# Altium schematic sheet BG1094_MIPI_CAM.SchDoc: =project_title
size Tabloid; PageSetup: Record=PageOptions|CenterHorizontal=True|CenterVertical=True|PrintScale=0.73|XCorrection=1.00|YCorrection=1.00|PrintKind=0|BorderSize=5000000|LeftOffset=0|BottomOffset=0|Orientation=2|PaperLength=1000|PaperWidth=1000|Scale=100|PaperSource=7|PrintQuality=-4|MediaType=1|DitherType=10|PaperKind=A4|PrintScaleMode=1; CompanyName: Luxonis Holding; Organization: Luxonis Holding; Address1: 1925 Harmony Park Drive; Address2: Westminster, CO; Address3: 80234; Address4: United States; SheetNumber: 2; SheetTotal: 5
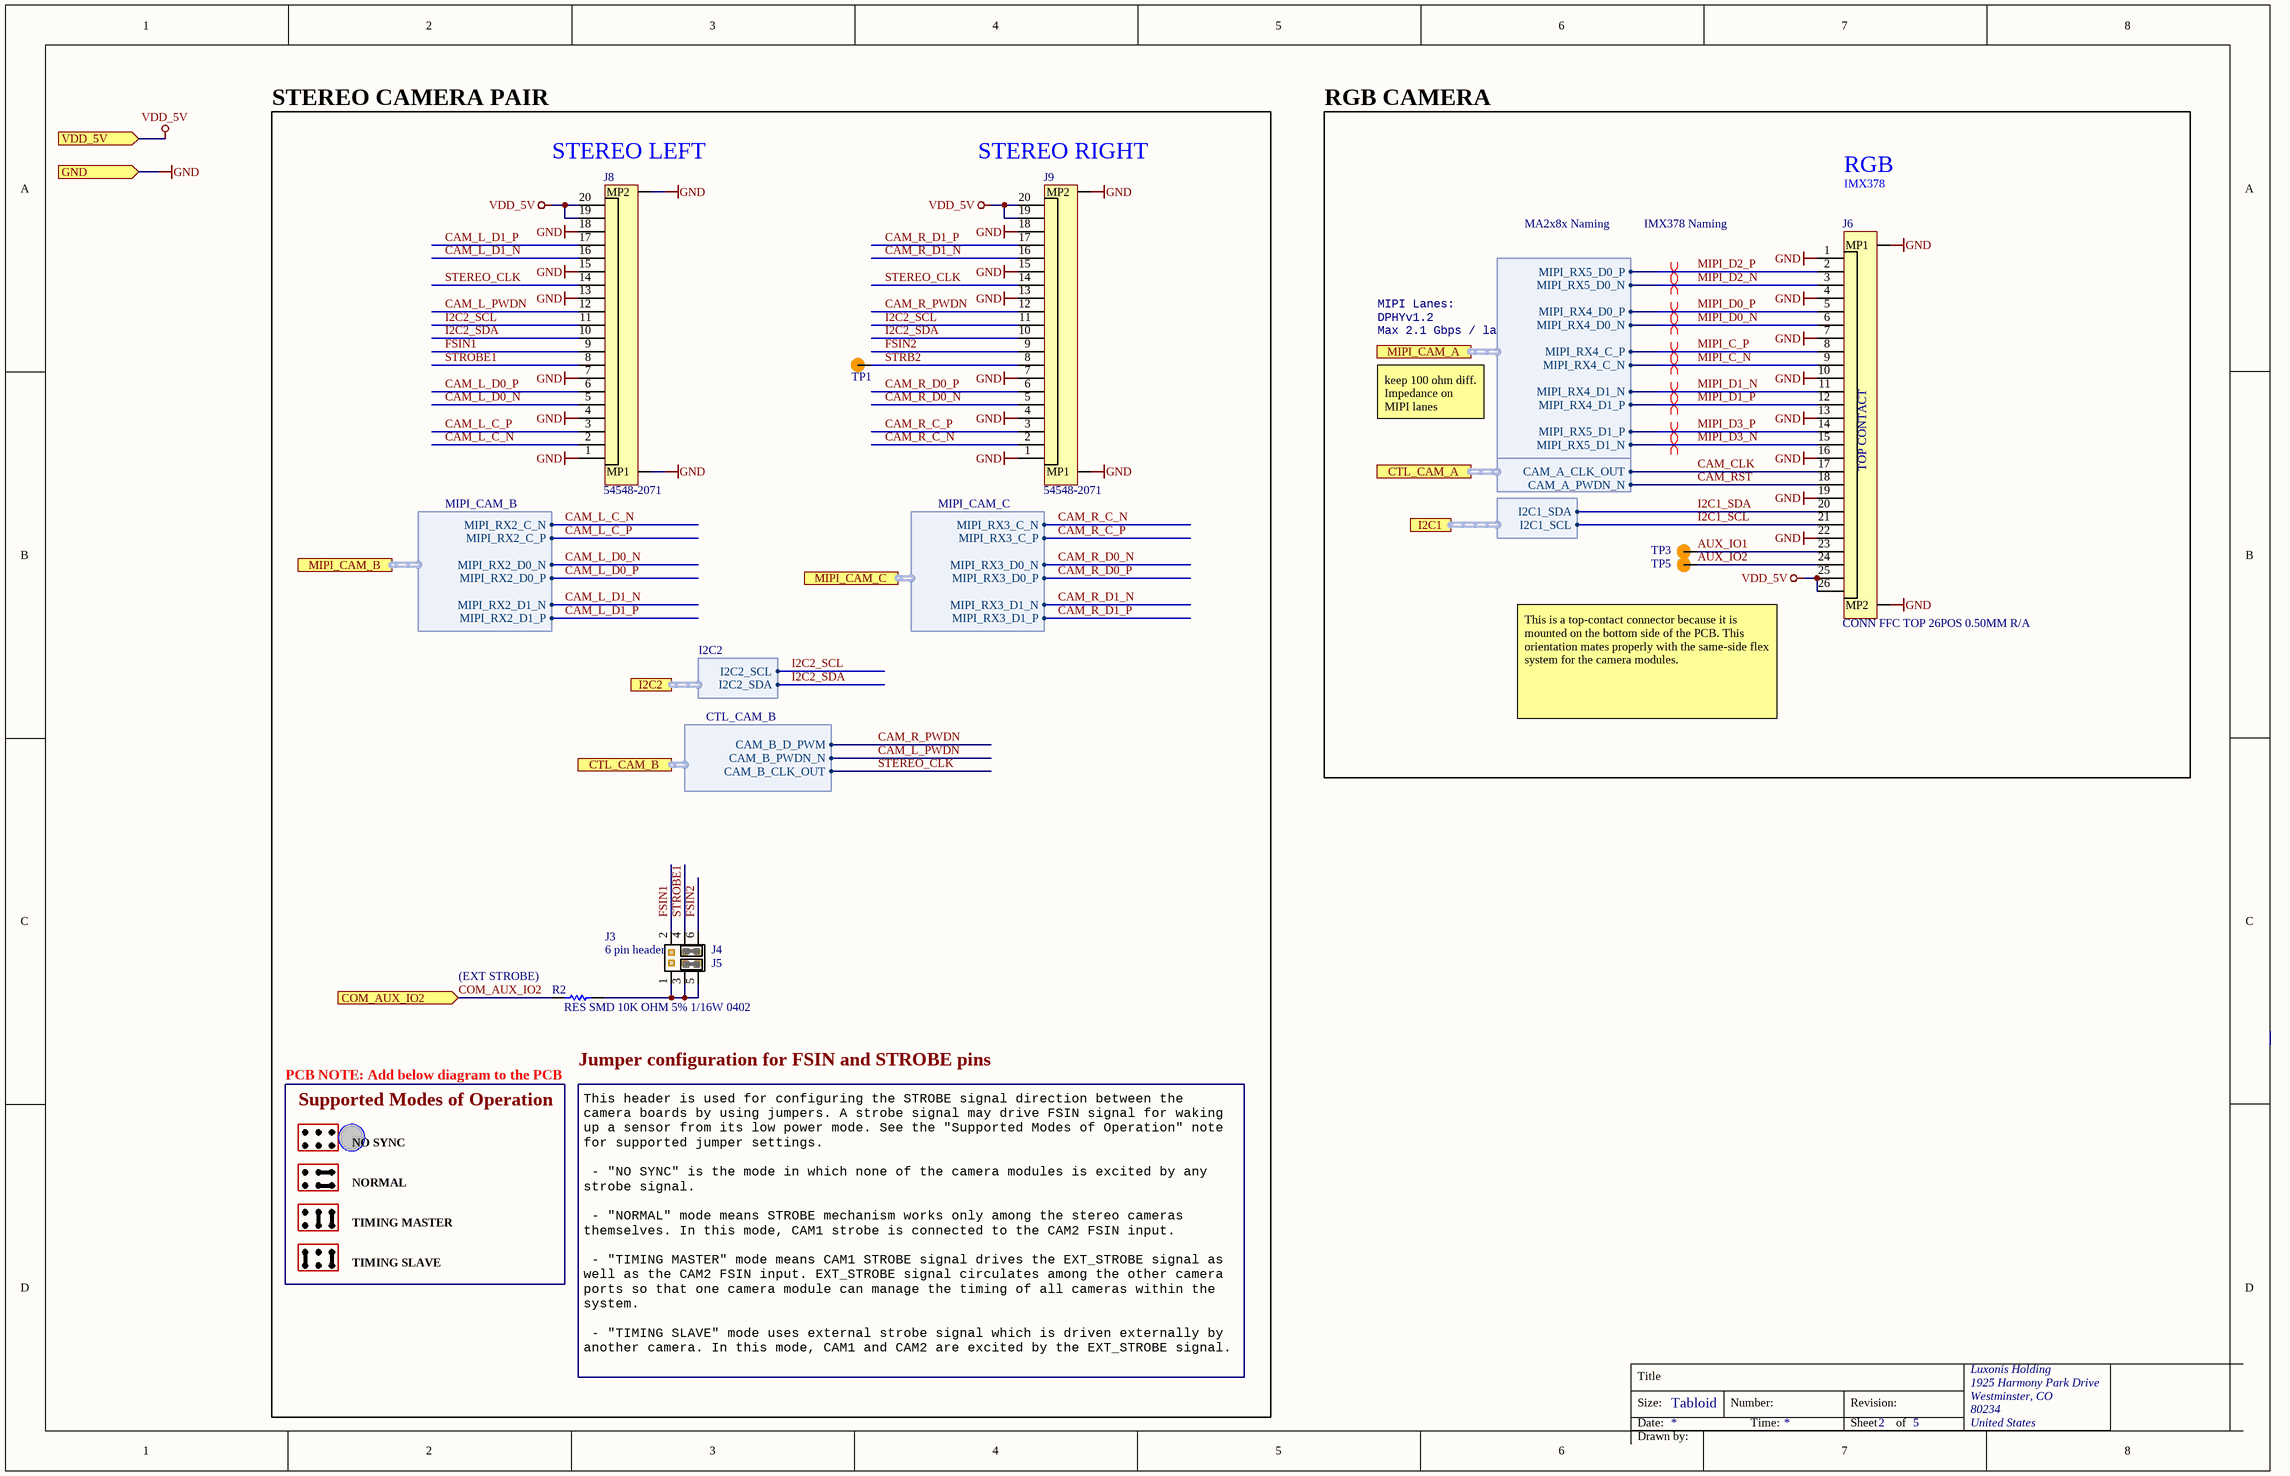
[diagram p0: BG1094_MIPI_CAM.SchDoc]

## Parts
J3  6 pin header  [con-20021121-00006C4LF]
J4  1.27mm hdr shunt  [HDR_SHUNT_1.27MM]  (value not drawn)
J5  1.27mm hdr shunt  [HDR_SHUNT_1.27MM]  (value not drawn)
J6  CONN FFC TOP 26POS 0.50MM R/A  [54550-2671]
J8  54548-2071  [545482071]
J9  54548-2071  [545482071]
R2  RES SMD 10K OHM 5% 1/16W 0402  [RESC0402(1005)_N]
TP1  TP_SMD  [TP_0.75MM_SMD_NO-SILK]  (value not drawn)  (no BOM)
TP3  TP100_200_NS  [TP100_200_NS]  (value not drawn)  (no BOM)
TP5  TP100_200_NS  [TP100_200_NS]  (value not drawn)  (no BOM)

## Ports
COM_AUX_IO2 (in), CTL_CAM_A (harness CTL_CAM_A), CTL_CAM_B (harness CTL_CAM_B), GND (in), I2C1 (harness I2C1), I2C2 (harness I2C2), MIPI_CAM_A (harness MIPI_CAM_A), MIPI_CAM_B (harness MIPI_CAM_B), MIPI_CAM_C (harness MIPI_CAM_C), VDD_5V (in)

## Harnesses
MIPI_CAM_B: MIPI_RX2_C_P, MIPI_RX2_C_N, MIPI_RX2_D0_P, MIPI_RX2_D0_N, MIPI_RX2_D1_P, MIPI_RX2_D1_N
I2C2: I2C2_SDA, I2C2_SCL
I2C1: I2C1_SDA, I2C1_SCL
MIPI_CAM_A: MIPI_RX5_D0_P, MIPI_RX5_D0_N, MIPI_RX4_D0_P, MIPI_RX4_D0_N, MIPI_RX4_C_P, MIPI_RX4_C_N, MIPI_RX4_D1_N, MIPI_RX4_D1_P, MIPI_RX5_D1_P, MIPI_RX5_D1_N
MIPI_CAM_C: MIPI_RX3_C_P, MIPI_RX3_C_N, MIPI_RX3_D0_P, MIPI_RX3_D0_N, MIPI_RX3_D1_P, MIPI_RX3_D1_N
CTL_CAM_A: CAM_A_PWDN_N, CAM_A_CLK_OUT
CTL_CAM_B: CAM_B_CLK_OUT, CAM_B_PWDN_N, CAM_B_D_PWM

## Nets
GND: J6.1 J6.4 J6.7 J6.10 J6.13 J6.16 J6.19 J6.22 J6.MP1 J6.MP2 J8.1 J8.4 J8.7 J8.13 J8.15 J8.18 J8.MP1 J8.MP2 J9.1 J9.4 J9.7 J9.13 J9.15 J9.18 J9.MP1 J9.MP2 ; port GND
VDD_5V: J6.25 J6.26 J8.19 J8.20 J9.19 J9.20 ; port VDD_5V
AUX_IO1: J6.23 TP3.1
AUX_IO2: J6.24 TP5.1
CAM_CLK: J6.17 ; port CTL_CAM_A.CAM_A_CLK_OUT
CAM_L_C_N: J8.2 ; port MIPI_CAM_B.MIPI_RX2_C_N
CAM_L_C_P: J8.3 ; port MIPI_CAM_B.MIPI_RX2_C_P
CAM_L_D0_N: J8.5 ; port MIPI_CAM_B.MIPI_RX2_D0_N
CAM_L_D0_P: J8.6 ; port MIPI_CAM_B.MIPI_RX2_D0_P
CAM_L_D1_N: J8.16 ; port MIPI_CAM_B.MIPI_RX2_D1_N
CAM_L_D1_P: J8.17 ; port MIPI_CAM_B.MIPI_RX2_D1_P
CAM_L_PWDN: J8.12 ; port CTL_CAM_B.CAM_B_PWDN_N
CAM_R_C_N: J9.2 ; port MIPI_CAM_C.MIPI_RX3_C_N
CAM_R_C_P: J9.3 ; port MIPI_CAM_C.MIPI_RX3_C_P
CAM_R_D0_N: J9.5 ; port MIPI_CAM_C.MIPI_RX3_D0_N
CAM_R_D0_P: J9.6 ; port MIPI_CAM_C.MIPI_RX3_D0_P
CAM_R_D1_N: J9.16 ; port MIPI_CAM_C.MIPI_RX3_D1_N
CAM_R_D1_P: J9.17 ; port MIPI_CAM_C.MIPI_RX3_D1_P
CAM_R_PWDN: J9.12 ; port CTL_CAM_B.CAM_B_D_PWM
CAM_RST: J6.18 ; port CTL_CAM_A.CAM_A_PWDN_N
COM_AUX_IO2: R2.1 ; port COM_AUX_IO2
FSIN1: J3.2 J8.9
FSIN2: J3.6 J9.9
I2C1_SCL: J6.21 ; port I2C1.I2C1_SCL
I2C1_SDA: J6.20 ; port I2C1.I2C1_SDA
I2C2_SCL: J8.11 J9.11 ; port I2C2.I2C2_SCL
I2C2_SDA: J8.10 J9.10 ; port I2C2.I2C2_SDA
MIPI_C_N: J6.9 ; port MIPI_CAM_A.MIPI_RX4_C_N
MIPI_C_P: J6.8 ; port MIPI_CAM_A.MIPI_RX4_C_P
MIPI_D0_N: J6.6 ; port MIPI_CAM_A.MIPI_RX4_D0_N
MIPI_D0_P: J6.5 ; port MIPI_CAM_A.MIPI_RX4_D0_P
MIPI_D1_N: J6.11 ; port MIPI_CAM_A.MIPI_RX4_D1_N
MIPI_D1_P: J6.12 ; port MIPI_CAM_A.MIPI_RX4_D1_P
MIPI_D2_N: J6.3 ; port MIPI_CAM_A.MIPI_RX5_D0_N
MIPI_D2_P: J6.2 ; port MIPI_CAM_A.MIPI_RX5_D0_P
MIPI_D3_N: J6.15 ; port MIPI_CAM_A.MIPI_RX5_D1_N
MIPI_D3_P: J6.14 ; port MIPI_CAM_A.MIPI_RX5_D1_P
STEREO_CLK: J8.14 J9.14 ; port CTL_CAM_B.CAM_B_CLK_OUT
STRB2: J9.8 TP1.1
STROBE1: J3.4 J8.8
NetJ3_1: J3.1 J3.3 J3.5 R2.2

## Layout directives
differential pair: MIPI_C_N, MIPI_C_P, MIPI_D0_N, MIPI_D0_P, MIPI_D1_N, MIPI_D1_P, MIPI_D2_N, MIPI_D2_P, MIPI_D3_N, MIPI_D3_P

## Notes on the sheet
- STEREO CAMERA PAIR
- (near J8) STEREO LEFT
- (near J9) STEREO RIGHT
- RGB CAMERA
- MA2x8x Naming
- IMX378 Naming
- RGB
- IMX378
- MIPI Lanes:
- Max 2.1 Gbps / lane
- DPHYv1.2
- keep 100 ohm diff. Impedance on MIPI lanes
- This is a top-contact connector because it is mounted on the bottom side of the PCB. This orientation mates properly with the same-side flex system for the camera modules.
- (near R2) (EXT STROBE)
- PCB NOTE: Add below diagram to the PCB
- Jumper configuration for FSIN and STROBE pins
- Supported Modes of Operation
- NO SYNC
- NORMAL
- TIMING MASTER
- TIMING SLAVE
- This header is used for configuring the STROBE signal direction between the camera boards by using jumpers. A strobe signal may drive FSIN signal for waking up a sensor from its low power mode. See the "Supported Modes of Operation" note for supported jumper settings.
  - "NO SYNC" is the mode in which none of the camera modules is excited by any strobe signal.
  - "NORMAL" mode means STROBE mechanism works only among the stereo cameras themselves. In this mode, CAM1 strobe is connected to the CAM2 FSIN input.
  - "TIMING MASTER" mode means CAM1 STROBE signal drives the EXT_STROBE signal as well as the CAM2 FSIN input. EXT_STROBE signal circulates among the other camera ports so that one camera module can manage the timing of all cameras within the system.
  - "TIMING SLAVE" mode uses external strobe signal which is driven externally by another camera. In this mode, CAM1 and CAM2 are excited by the EXT_STROBE signal.
  Note that, at most only one camera can be in the "TIMING MASTER" mode at a time. STROBE generation and FSIN reception should be configured via software.
- Title
- Size:
- Date:
- Tabloid
- Number:
- Time:
- Revision:
- Sheet
- of
- Drawn by:
- (in symbol 54550-2671) TOP CONTACT

## Library data of the parts
J3 = HDR_2x3_1.27mm
J4 J5 = HDR_Shunt_1.27mm: CONN SHUNT 1.27MM BLACK (M50-1900005); Manufacturer 1: Harwin; Manufacturer Part Number 1: M50-1900005
J6 = 54550-2671: Manufacturer 1: Molex; Actuator Material: Polyphenylene; Current Rating: 500mA; Voltage Rating: 50V; Contact Resistance: 40mR; Number of Positions: 26; Wire/Cable Type: Straight; Mating Cycles: 20; Pitch: 0.5mm; Supplier 1: Digi-Key; Manufacturer Part Number 1: 54550-2671; Stock 1: 6245; Pricing 1: 1=2.84000, 10=2.72700, 25=2.50000, 50=2.38620, 100=2.27260, 250=1.98852 (USD); RoHS: Yes; Mount: Surface Mount; Contact Material: Bronze; Contact Plating: Gold; Housing Material: Polymer; Housing Color: Natural; Min Operating Temperature: -20°C; Max Operating Temperature: 85°C; Packaging: Tape and Reel; Package Quantity: 750; Number of Rows: 1; Termination: Solder; Number of Contacts: 26; Orientation: Right Angle; Length: 18.2mm; Depth: 5mm; Flammability Rating: UL94 V-0; ComponentLink1URL: https://datasheet.ciiva.com/5136/0545502671-ffc-fpc-connectors-228748-5136548.pdf?src-supplier=Mouser; ComponentLink1Description: https://datasheet.ciiva.com/5136/0545502671-ffc-fpc-connectors-228748-5136548.pdf?src-supplier=Mouser; ComponentLink2URL: https://datasheet.ciiva.com/3925/24240545502671-ffc-fpc-nectors-3925432.pdf?src-supplier=Arrow; ComponentLink2Description: https://datasheet.ciiva.com/3925/24240545502671-ffc-fpc-nectors-3925432.pdf?src-supplier=Arrow; ComponentLink3URL: https://datasheet.ciiva.com/16659/0545502671-ffc-fpc-connectors-16659849.pdf?src-supplier=Avnet+Europe; ComponentLink3Description: https://datasheet.ciiva.com/16659/0545502671-ffc-fpc-connectors-16659849.pdf?src-supplier=Avnet+Europe; ComponentLink4URL: https://datasheet.ciiva.com/15177/getdatasheetpartid-704282-15177102.pdf?src-supplier=Verical; ComponentLink4Description: https://datasheet.ciiva.com/15177/getdatasheetpartid-704282-15177102.pdf?src-supplier=Verical; ComponentLink5URL: https://datasheet.ciiva.com/15245/285330545502671-ffc-fpc-nectors-15245807.pdf?src-supplier=Arrow+Europe; ComponentLink5Description: https://datasheet.ciiva.com/15245/285330545502671-ffc-fpc-nectors-15245807.pdf?src-supplier=Arrow+Europe; ComponentLink6URL: https://datasheet.ciiva.com/10366/0545502671-ffc-fpc-connectors-10366875.pdf?src-supplier=Avnet; ComponentLink6Description: https://datasheet.ciiva.com/10366/0545502671-ffc-fpc-connectors-10366875.pdf?src-supplier=Avnet; Supplier 2: Digi-Key; Supplier 3: Mouser; Supplier 4: Arrow; Supplier Part Number 1: WM8809CT-ND; Supplier Part Number 2: WM8809TR-ND; Supplier Part Number 3: 538-54550-2671; Supplier Part Number 4: 54550-2671
J8 J9 = 54548-2071: FFC & FPC Connectors 0.5 FPC ZIF Hsg Assy ssy 20Ckt EmbsTp Pkg; Manufacturer_Name: Molex; Manufacturer_Part_Number: 54548-2271; Datasheet Link: http://www.molex.com/webdocs/datasheets/pdf/en-us//0545482271_FFC_FPC_CONNECTORS.pdf; Height: 1mm; Mouser Part Number: 538-54548-2271; Mouser Price/Stock: https://www.mouser.com/Search/Refine.aspx?Keyword=538-54548-2271
R2 = !RES
TP1 = TP_SMD: circular pad test point, SMD
TP3 TP5 = TEST_POINT